# EAGLE design LM338 PSU RevC (EAGLE 7.4.0)
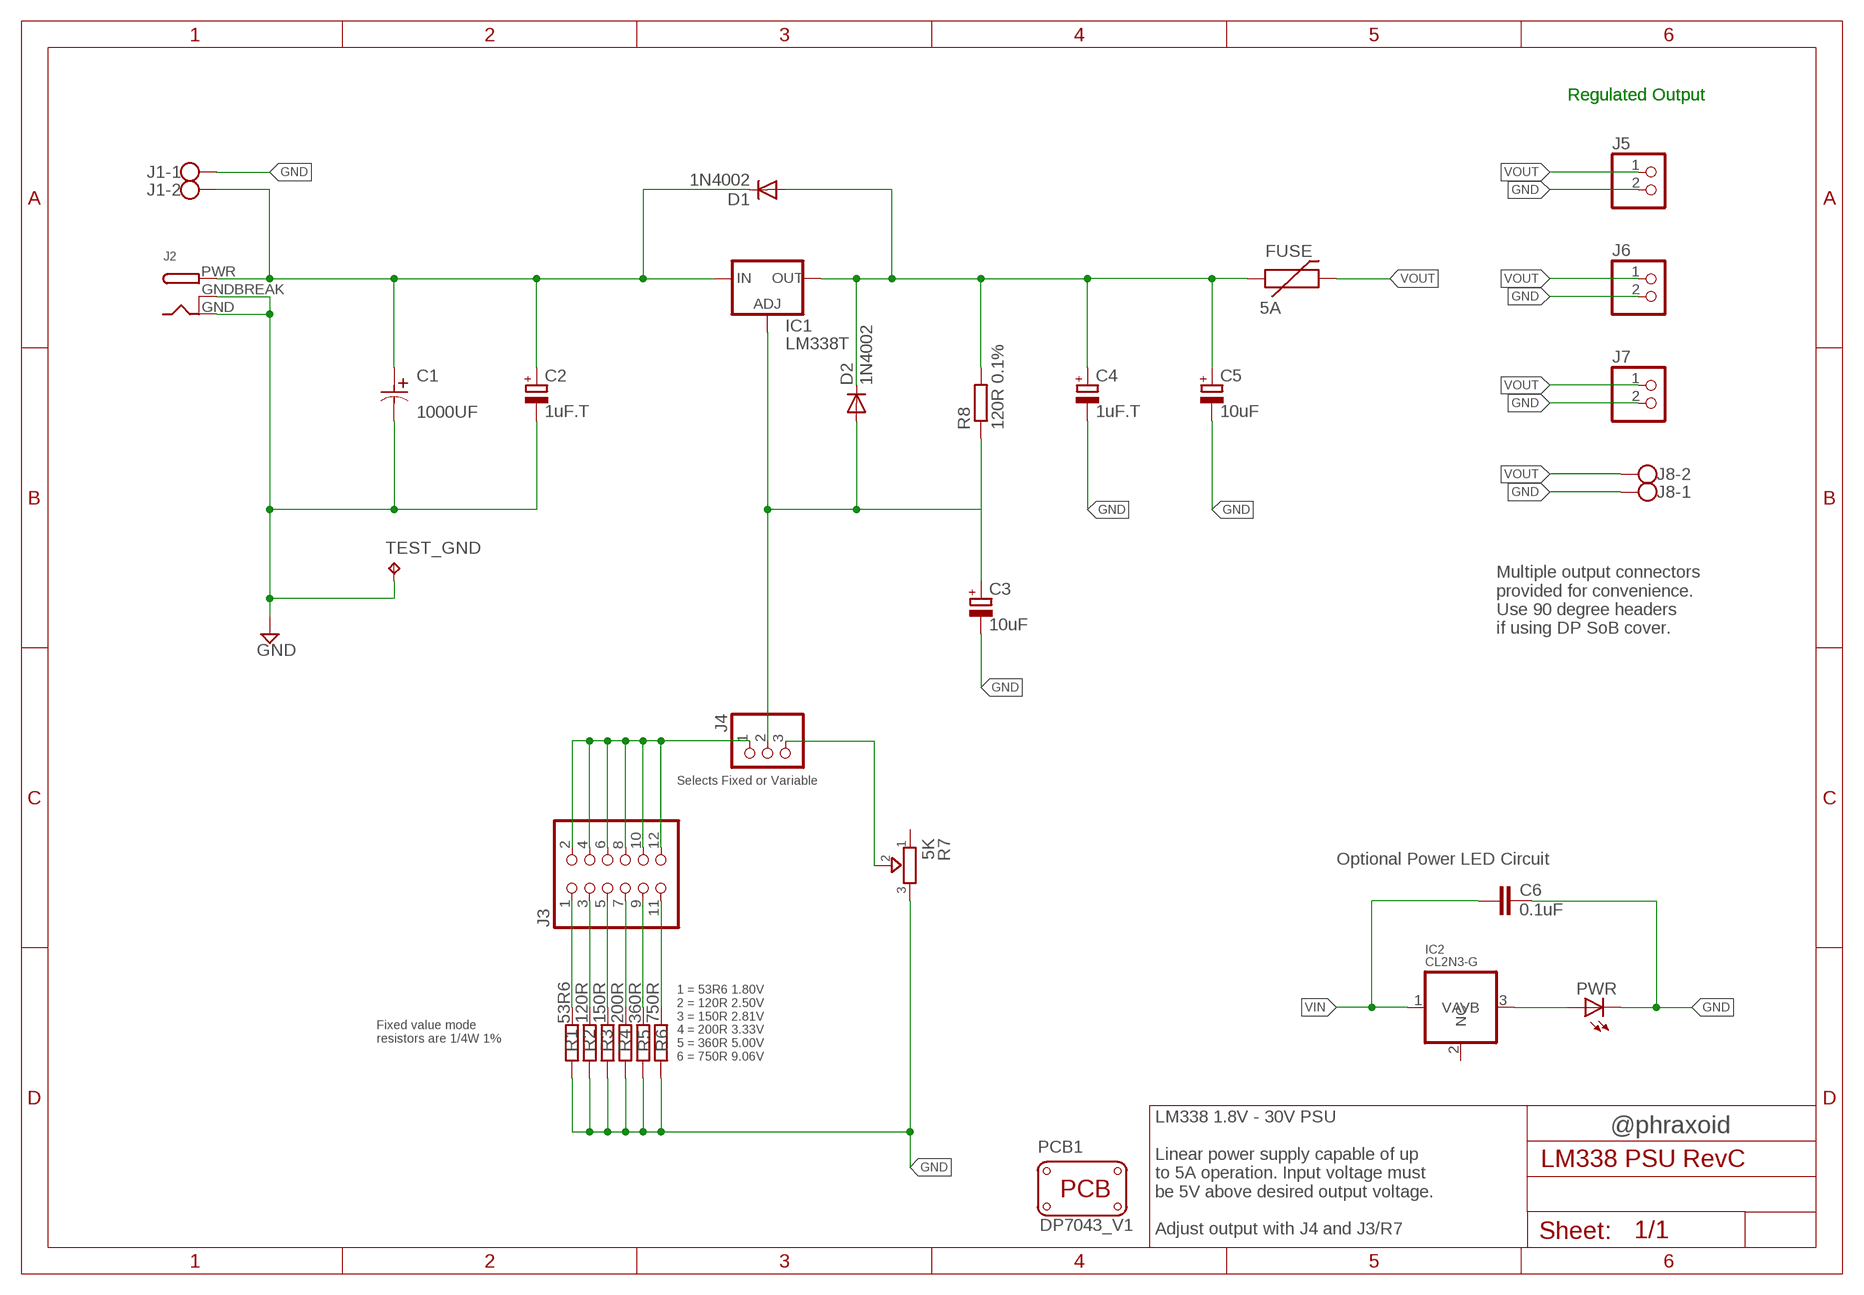
[diagram p0: schematic, sheet 1]

## Parts
C1  1000UF  ECA1HHG102-D12.5XP5  [CAPPR500-1250X2500]
C2  1uF.T  CPOL-EUE5-4  [E5-4]
C3  10uF  CPOL-EUE2.5-7  [E2,5-7]
C4  1uF.T  CPOL-EUE5-4  [E5-4]
C5  10uF  CPOL-EUE2.5-7  [E2,5-7]
C6  0.1uF  C-EU025-025X050  [C025-025X050]
D1  1N4002  1N4004  [DO41-10]
D2  1N4002  1N4004  [DO41-10]
FUSE  5A  PTCPTH  [PTC]
IC1  LM338T  V_REG_317SINK  [TO220-ADJ]
IC2  CL2N3-G  [TO-92]
J1  W237-102  [W237-102]
J2  DCBARRELPTH  [DCJACK_2MM_PTH]
J3  PINHD-2X6  [2X06]
J4  PINHD-1X3/90  [1X03/90]
J5  PINHD-1X2/90  [1X02/90]
J6  PINHD-1X2/90  [1X02/90]
J7  PINHD-1X2/90  [1X02/90]
J8  W237-102  [W237-102]
PCB1  PCB_DP_RECTANGLE-43X70  [DP7043_V1]
PWR  LED5MM  [LED5MM]
R1  53R6  R-EU_0207/10  [0207/10]
R2  120R  R-EU_0207/10  [0207/10]
R3  150R  R-EU_0207/10  [0207/10]
R4  200R  R-EU_0207/10  [0207/10]
R5  360R  R-EU_0207/10  [0207/10]
R6  750R  R-EU_0207/10  [0207/10]
R7  5K  TRIMMER-3362P  [TRIMMER_3362P]
R8  120R 0.1%  R-EU_0207/10  [0207/10]
TEST_GND  TPPAD1-13  [P1-13]

## Nets
ADJ: C3.+ D2.A IC1.ADJ J4.2 R8.1
GND: C1.2 C2.- C3.- C4.- C5.- C6.2 J1.1 J2.GND J2.GNDBREAK J5.2 J6.2 J7.2 J8.1 PWR.K(C) R1.1 R2.1 R3.1 R4.1 R5.1 R6.1 R7.3 TEST_GND.TP
N$1: J3.2 J3.4 J3.6 J3.8 J3.10 J3.12 J4.1
N$2: J4.3 R7.2
N$3: J3.1 R1.2
N$4: J3.3 R2.2
N$5: J3.5 R3.2
N$6: J3.7 R4.2
N$7: J3.9 R5.2
N$8: J3.11 R6.2
N$9: IC2.3(VB) PWR.A
OUT: C4.+ C5.+ D1.A D2.C FUSE.P$1 IC1.OUT R8.2
VIN: C1.1 C2.+ C6.1 D1.C IC1.IN IC2.1(VA) J1.2 J2.PWR
VOUT: FUSE.P$2 J5.1 J6.1 J7.1 J8.2
Unconnected: IC2.2(NC) R7.1

## Notes on the sheet
- Regulated Output | Regulated Output
- Multiple output connectors
  provided for convenience.
  Use 90 degree headers
  if using DP SoB cover.
- Selects Fixed or Variable
- Optional Power LED Circuit
- Fixed value mode
  resistors are 1/4W 1%
- 1 = 53R6 1.80V
  2 = 120R 2.50V
  3 = 150R 2.81V
  4 = 200R 3.33V
  5 = 360R 5.00V
  6 = 750R 9.06V
- LM338 1.8V - 30V PSU
  
  Linear power supply capable of up
  to 5A operation. Input voltage must
  be 5V above desired output voltage.
  
  Adjust output with J4 and J3/R7
- @phraxoid

## Library data of the parts
C1 = Panasonic-ECA_01:ECA: Aluminum Electrolytic Capacitors/Radial Lead Type; MF: PANASONIC; MPN: ECA1HM102; OC_FARNELL: 9693823; OC_NEWARK: 96K9163; PACKAGE: Radial Lead-TH; SUPPLIER: PANASONIC; TOLERANCE: ±20 %; VOLTAGERATING: 50V
C2 C4 = rcl:CPOL-EU: POLARIZED CAPACITOR, European symbol; OC_FARNELL: unknown
C3 C5 = rcl:CPOL-EU: POLARIZED CAPACITOR, European symbol; MF: PANASONIC; MPN: ECEA1HN100U; OC_FARNELL: 9696636
C6 = rcl:C-EU: CAPACITOR, European symbol; MF: AVX; MPN: 02016D104KAT2A; OC_FARNELL: 1657913
D1 D2 = diode:1N4004: DIODE general purpose rectifier, 1 A; MF: ON SEMICONDUCTOR; MPN: 1N4002RLG; OC_FARNELL: 1264225
FUSE = SparkFun-PowerIC:PTC: Resettable Fuse PTC Resettable Fuse. Spark Fun Electronics SKU : COM-08357; MF: LITTELFUSE; MPN: 30R400UF; OC_FARNELL: 1822241
IC1 = SparkFun-PowerIC:V_REG_317: Voltage Regulator Standard LM317 adjustable voltage regulator. AOI (Adjust Output Input). Google 'LM317 Calculator' for easy to use app to get the two resistor values needed. 240/720 for 5V output. 240/390 for 3.3V output. Spark Fun Electronics SKU : COM-00527; MF: TEXAS INSTRUMENTS; MPN: LM338T/NOPB; OC_FARNELL: 1469094
IC2 = engnr.cc-v1:CL2N3-G; OC_FARNELL: unknown
J1 J8 = con-wago-500:W237-102: WAGO SCREW CLAMP; MF: MULTICOMP; MPN: MC000048; OC_FARNELL: 2008019; OC_NEWARK: 70K9898
J2 = adafruit:DCBARREL: 2.0mm DC Barrel Jack DCJACK_2MM_PTH - Through Hole Jack (4UConnector: 05537); OC_FARNELL: unknown
J3 = pinhead:PINHD-2X6: PIN HEADER; OC_FARNELL: unknown
J4 = pinhead:PINHD-1X3: PIN HEADER; MF: MULTICOMP; MPN: MC34747; OC_FARNELL: 1593427
J5-J7 = pinhead:PINHD-1X2: PIN HEADER; MF: MULTICOMP; MPN: MC34745; OC_FARNELL: 1593426
PCB1 = dp_devices:PCB_DP_RECTANGLE: Dangerous Prototypes Standard Rectangular PCB sizes; OC_FARNELL: unknown; PCB_SIZE: DP7043_V1
PWR = adafruit:LED: LED OSRAM: - CHIPLED LG R971, LG N971, LY N971, LG Q971, LY Q971, LO R971, LY R971 LH N974, LH R974 LS Q976, LO Q976, LY Q976 LO Q996 - Hyper CHIPLED LW Q18S LB Q993, LB Q99A, LB R99A - SideLED LS A670, LO A670, LY A670, LG A670, LP A670 LB A673, LV A673, LT A673, LW A673 LH A674 LY A675 LS A676, LA A676, LO A676, LY A676, LW A676 LS A679, LY A679, LG A679 - Hyper Micro SIDELED® LS Y876, LA Y876, LO Y876, LY Y876 LT Y87S - SmartLED LW L88C, LW L88S LB L89C, LB L89S, LG L890 LS L89K, LO L89K, LY L89K LS L896, LA L896, LO L896, LY L896 - TOPLED LS T670, LO T670, LY T670, LG T670, LP T670 LSG T670, LSP T670, LSY T670, LOP T670, LYG T670 LG T671, LOG T671, LSG T671 LB T673, LV T673, LT T673, LW T673 LH T674 LS T676, LA T676, LO T676, LY T676, LB T676, LH T676, LSB T676, LW T676 LB T67C, LV T67C, LT T67C, LS T67K, LO T67K, LY T67K, LW E67C LS E67B, LA E67B, LO E67B, LY E67B, LB E67C, LV E67C, LT E67C LW T67C LS T679, LY T679, LG T679 LS T770, LO T770, LY T770, LG T770, LP T770 LB T773, LV T773, LT T773, LW T773 LH T774 LS E675, LA E675, LY E675, LS T675 LS T776, LA T776, LO T776, LY T776, LB T776 LHGB T686 LT T68C, LB T68C - Hyper Mini TOPLED® LB M676 - Mini TOPLED Santana® LG M470 LS M47K, LO M47K, LY M47K Source: http://www.osram.convergy.de/; MF: CREE; MPN: C503B-RBN-CX0Y0AA1; OC_FARNELL: 1855569
R1 = rcl:R-EU_: RESISTOR, European symbol; MF: TE CONNECTIVITY / HOLSWORTHY; MPN: H853R6BYA; OC_FARNELL: 1751303
R2 = rcl:R-EU_: RESISTOR, European symbol; MF: WELWYN; MPN: PR5Y-120RBI; OC_FARNELL: 1634027
R3 = rcl:R-EU_: RESISTOR, European symbol; MF: TE CONNECTIVITY / HOLSWORTHY; MPN: H8150RBYA; OC_FARNELL: 1751336
R4 = rcl:R-EU_: RESISTOR, European symbol; MF: TE CONNECTIVITY / HOLSWORTHY; MPN: H8200RBYA; OC_FARNELL: 1751365
R5 = rcl:R-EU_: RESISTOR, European symbol; MF: MULTICOMP; MPN: MF25 360R; OC_FARNELL: 9341790
R6 = rcl:R-EU_: RESISTOR, European symbol; MF: TE CONNECTIVITY / HOLSWORTHY; MPN: H8750RBYA; OC_FARNELL: 1751430
R7 = dp_devices:TRIMMER: Trimmer resistor; MF: BOURNS; MPN: 3362P-1-502LF; OC_FARNELL: 9354379
R8 = rcl:R-EU_: RESISTOR, European symbol; MF: MULTICOMP; MPN: MF25 120R; OC_FARNELL: 9341218
TEST_GND = testpad:TP: Test pad; OC_FARNELL: unknown

## Board
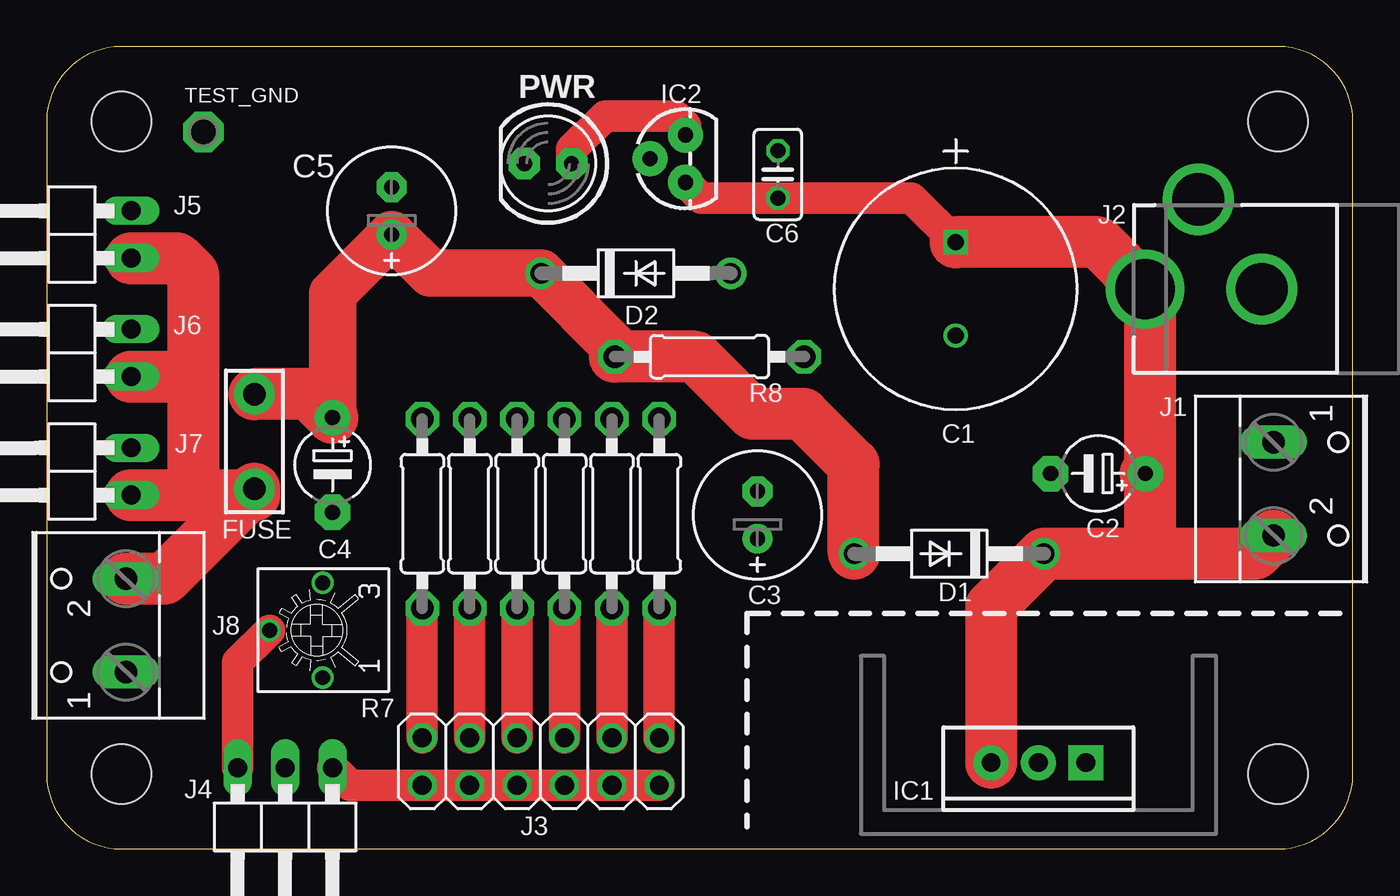
[diagram p1: board, top side]
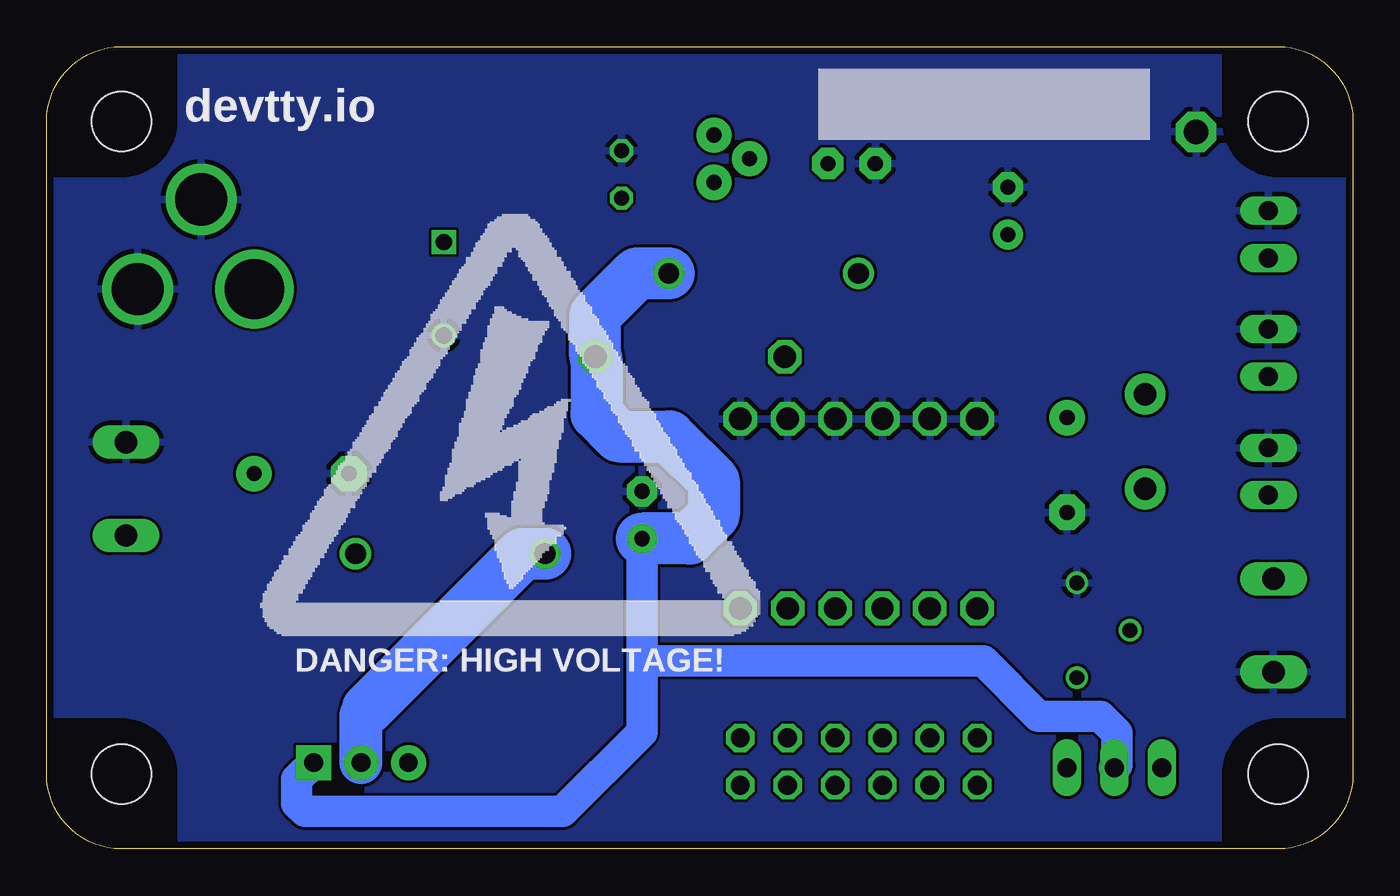
[diagram p2: board, bottom side, seen from below]

Size 70 x 43 mm. Coordinates in mm from the lower left corner, seen from the top.
Copper layers (1*16): Top 0.0356mm / dielectric 1.5011mm / Bottom 0.0356mm
Design rules "oshpark-2layer": minimum track width 6mil, minimum drill 13mil, track to track 6mil, track to pad 6mil, pad to pad 6mil, via to via 6mil, smd to smd 6mil, copper to edge 15mil, drill to drill 6mil, minimum pad ring 7mil, minimum via ring 7mil, stop-mask expansion 2.5mil, vias tented up to drill 0mil, thermal gap 10mil

### Footprints (pad centres in the part's own frame; a part is rotated, then mirrored left to right if it is on the bottom)
CAPPR500-1250X2500 = drill 0.864 square: 1 -5.004,0 | drill 0.864: 2 0,0
E5-4 = drill 0.813 pad 1.905: + -2.54,0 | drill 0.813 pad 1.905 octagon: - 2.54,0
E2,5-7 = drill 0.813 pad 1.6: + -1.27,0 | drill 0.813 pad 1.6 octagon: - 1.27,0
C025-025X050 = drill 0.813 octagon: 1 -1.27,0; 2 1.27,0
DO41-10 = drill 1.118: A 5.08,0; C -5.08,0
PTC = drill 1.2 pad 2.184: P$1 -2.54,0; P$2 2.54,0
TO220-ADJ = drill 1 pad 1.88 square: ADJ -2.54,0 | drill 1 pad 1.88: IN 2.54,0; OUT 0,0
TO-92 = drill 0.813 pad 1.88: 1 -1.27,0; 2 0,1.905; 3 1.27,0
W237-102 = drill 1.194 long: 1 -2.5,-1.27; 2 2.5,-1.27
DCJACK_2MM_PTH = drill 2.8: GND 0,7.35; GNDBREAK 4.8,10.75 | drill 3.2: PWR 0,13.6
2X06 = drill 1.016 octagon: 1 -6.35,-1.27; 2 -6.35,1.27; 3 -3.81,-1.27; 4 -3.81,1.27; 5 -1.27,-1.27; 6 -1.27,1.27; 7 1.27,-1.27; 8 1.27,1.27; 9 3.81,-1.27; 10 3.81,1.27; 11 6.35,-1.27; 12 6.35,1.27
1X03/90 = drill 1.016 long: 1 -2.54,-3.81; 2 0,-3.81; 3 2.54,-3.81
1X02/90 = drill 1.016 long: 1 -1.27,-3.81; 2 1.27,-3.81
DP7043_V1 = hole 3.2: -31,-17.5; 31,-17.5; 31,17.5; -31,17.5
LED5MM = drill 0.813 pad 1.676 octagon: A -1.27,0; K 1.27,0
0207/10 = drill 1.2 octagon: 1 -5.08,0; 2 5.08,0
TRIMMER_3362P = drill 0.8: 1 -2.54,-0.31; 2 0,2.54; 3 2.54,-0.31
P1-13 = drill 1.321 pad 2.159 octagon: TP 0,0

### Placement (x,y rotation side)
C1  48.72,27.52 270 top
C2  56.35,20.11 180 top
C3  38.09,17.9 90 top
C4  15.31,20.58 270 top
C5  18.49,34.2 90 top
C6  39.19,36.15 90 top
D1  48.37,15.82 180 top
D2  31.58,30.85 0 top
FUSE  11.13,21.84 270 top
IC1  53.15,4.62 180 top
IC2  34.24,36.99 90 top
J1  67.02,19.3 270 top
J2  72.47,30.01 90 top
J3  26.48,4.68 180 top
J4  12.77,0.55 180 top
J5  0.71,32.93 90 top
J6  0.71,26.58 90 top
J7  0.71,20.23 90 top
J8  2.98,11.97 90 top
PCB1  35,21.5 0 top
PWR  26.87,36.73 180 top
R1  32.83,17.97 270 top
R2  30.29,17.97 270 top
R3  27.75,17.97 270 top
R4  25.21,17.97 270 top
R5  22.67,17.97 270 top
R6  20.13,17.97 270 top
R7  14.48,11.72 90 top
R8  35.52,26.38 180 top
TEST_GND  8.4,38.43 0 top

### Tracks (layer width: path | path; a pad name or v marks a point on that pad's centre or on a via)
ADJ
  Bottom 1.676: IC1.ADJ 56.59,3.72 56.59,2.45 56.15,2.01 42.34,2.01 38.09,6.26 38.09,10.07 | 38.09,10.07 C3.+ | J4.2 12.64,4.49 12.64,6.21 13.54,7.11 16.84,7.11 19.8,10.07 38.09,10.07
  Bottom 2.794: D2.A 38.35,30.85 40.6,28.6 R8.1 40.54,26.32 40.54,23.31 39.34,22.11 36.64,22.11 34.24,19.71 34.24,17.91 35.52,16.63 C3.+
GND
  pour Bottom: -0.56,43.09 70.56,43.09 70.56,-0.09 -0.56,-0.09
N$1
  Top 1.676: J3.2 J3.4 J3.6 J3.8 J3.10 J3.12 16.26,3.41 J4.1
N$2
  Top 1.676: J4.3 10.23,10.02 R7.2
N$3
  Top 1.676: J3.1 R1.2
N$4
  Top 1.676: J3.3 R2.2
N$5
  Top 1.676: J3.5 R3.2
N$6
  Top 1.676: R4.2 J3.7
N$7
  Top 1.676: J3.9 R5.2
N$8
  Top 1.676: R6.2 J3.11
N$9
  Top 1.676: IC2.3 34.24,38.77 33.73,39.28 29.92,39.28 28.14,37.5 PWR.A
OUT
  Top 2.54: R8.2 30.44,26.91 D2.C 20.57,30.85 C5.+ 15.31,29.75 C4.+
  Top 2.794: D1.A 43.24,15.87 43.24,20.61 40.54,23.31 37.84,23.31 34.77,26.38 R8.2 | C4.+ 14.06,24.38 FUSE.P$1
  Bottom 2.3: IC1.OUT 53.15,7.16 52.78,7.53
  Bottom 2.794: D1.A 44.49,15.82 52.78,7.53
VIN
  Top 1.676: C1.1 46.35,34.88 C6.1 35.08,34.88 IC2.1
  Top 2.794: C1.1 56.35,32.52 J2.PWR 59.13,29.74 59.13,19.87 | J1.2 64.77,15.82 59.13,15.82 | 59.13,15.82 D1.C 50.61,12.98 IC1.IN | C2.+ 59.13,19.87 | 59.13,19.87 59.13,15.82
VOUT
  Top 2.794: J8.2 6.31,14.47 FUSE.P$2 11.13,18.96 8.33,18.96 | J7.1 8.33,18.96 | J5.1 6.99,31.66 7.84,30.81 7.84,25.31 | 7.84,25.31 7.84,19.45 8.33,18.96 | J6.1 7.84,25.31

### Text on the board
tNames: IC1
bNames: devtty.io | DANGER: HIGH VOLTAGE!
bStop: Serial#
tDocu: 5A/50W Linear PSU | @phraxoid | + | + | + | + | + | 9.00V | 5.00V | 3.33V | 2.80V | 2.50V | 1.80V | CAUTION: / HOT! | ##- Variable / -## Fixed